# Altium project Light Sensor Node.PrjPcb
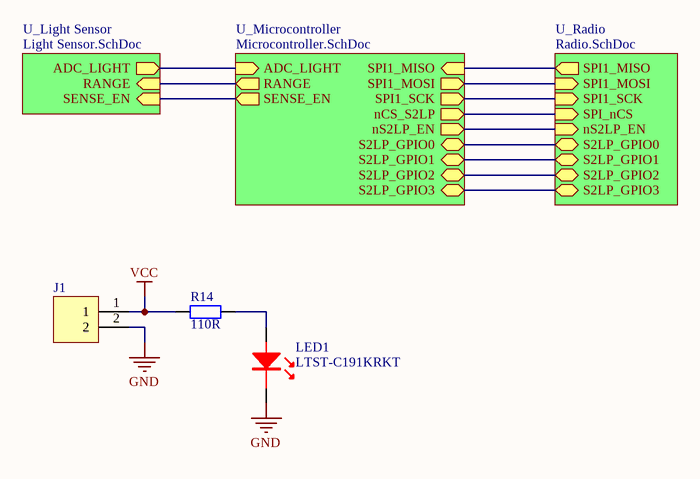
[diagram p0: Light Sensor Node.SchDoc]
4 sheets, 100 parts. Net scope: hierarchical (ports join the sheet entries above them; power ports are global).
Board file: Light Sensor Node.PcbDoc
Sheets:
  Light Sensor Node.SchDoc
    U_Microcontroller = Microcontroller.SchDoc
    U_Light Sensor = Light Sensor.SchDoc
    U_Radio = Radio.SchDoc

## Sheet Light Sensor Node.SchDoc
size A4

### Parts
J1  22-05-3021  [MOLEX_22-05-3021]  (value not drawn)
LED1  LTST-C191KRKT  [LITEON_LTST-C191KRKT]
R14  110R  [R0603]

### Sub-sheets
U_Light Sensor = Light Sensor.SchDoc: ADC_LIGHT (out), RANGE (in), SENSE_EN (in)
U_Microcontroller = Microcontroller.SchDoc: ADC_LIGHT (in), RANGE (out), SPI1_SCK (out), SPI1_MISO (in), SPI1_MOSI (out), nCS_S2LP (out), nS2LP_EN (out), SENSE_EN (out), S2LP_GPIO2 (bidir), S2LP_GPIO1 (bidir), S2LP_GPIO0 (bidir), S2LP_GPIO3 (bidir)
U_Radio = Radio.SchDoc: SPI1_SCK (in), SPI1_MISO (out), SPI1_MOSI (in), SPI_nCS (in), nS2LP_EN (in), S2LP_GPIO1 (bidir), S2LP_GPIO2 (bidir), S2LP_GPIO3 (bidir), S2LP_GPIO0 (bidir)

### Nets
GND: J1.2 LED1.K
VCC: J1.1 R14.1
ADC_LIGHT: sheet U_Microcontroller/ADC_LIGHT, sheet U_Light Sensor/ADC_LIGHT
GPIO0: sheet U_Microcontroller/S2LP_GPIO0, sheet U_Radio/S2LP_GPIO0
GPIO1: sheet U_Microcontroller/S2LP_GPIO1, sheet U_Radio/S2LP_GPIO1
GPIO2: sheet U_Microcontroller/S2LP_GPIO2, sheet U_Radio/S2LP_GPIO2
GPIO3: sheet U_Microcontroller/S2LP_GPIO3, sheet U_Radio/S2LP_GPIO3
nCS: sheet U_Microcontroller/nCS_S2LP, sheet U_Radio/SPI_nCS
nS2LP_EN: sheet U_Microcontroller/nS2LP_EN, sheet U_Radio/nS2LP_EN
RANGE: sheet U_Microcontroller/RANGE, sheet U_Light Sensor/RANGE
SENSE_EN: sheet U_Microcontroller/SENSE_EN, sheet U_Light Sensor/SENSE_EN
SPI1_MISO: sheet U_Microcontroller/SPI1_MISO, sheet U_Radio/SPI1_MISO
SPI1_MOSI: sheet U_Microcontroller/SPI1_MOSI, sheet U_Radio/SPI1_MOSI
SPI1_SCK: sheet U_Microcontroller/SPI1_SCK, sheet U_Radio/SPI1_SCK
NetLED1_A: LED1.A R14.2

### Library data of the parts
J1 = 2WAY: Manufacturer: Molex; Manufacturer Part Number: 22-05-3021
LED1 = LED_Red: Manufacturer: Lite On; Manufacturer Part Number: LTST-C191KRKT
R14 = RES: Manufacturer: Yageo; Manufacturer Part Number: RC0603FR-07110RL; Footprint: *

## Sheet Microcontroller.SchDoc
size A4
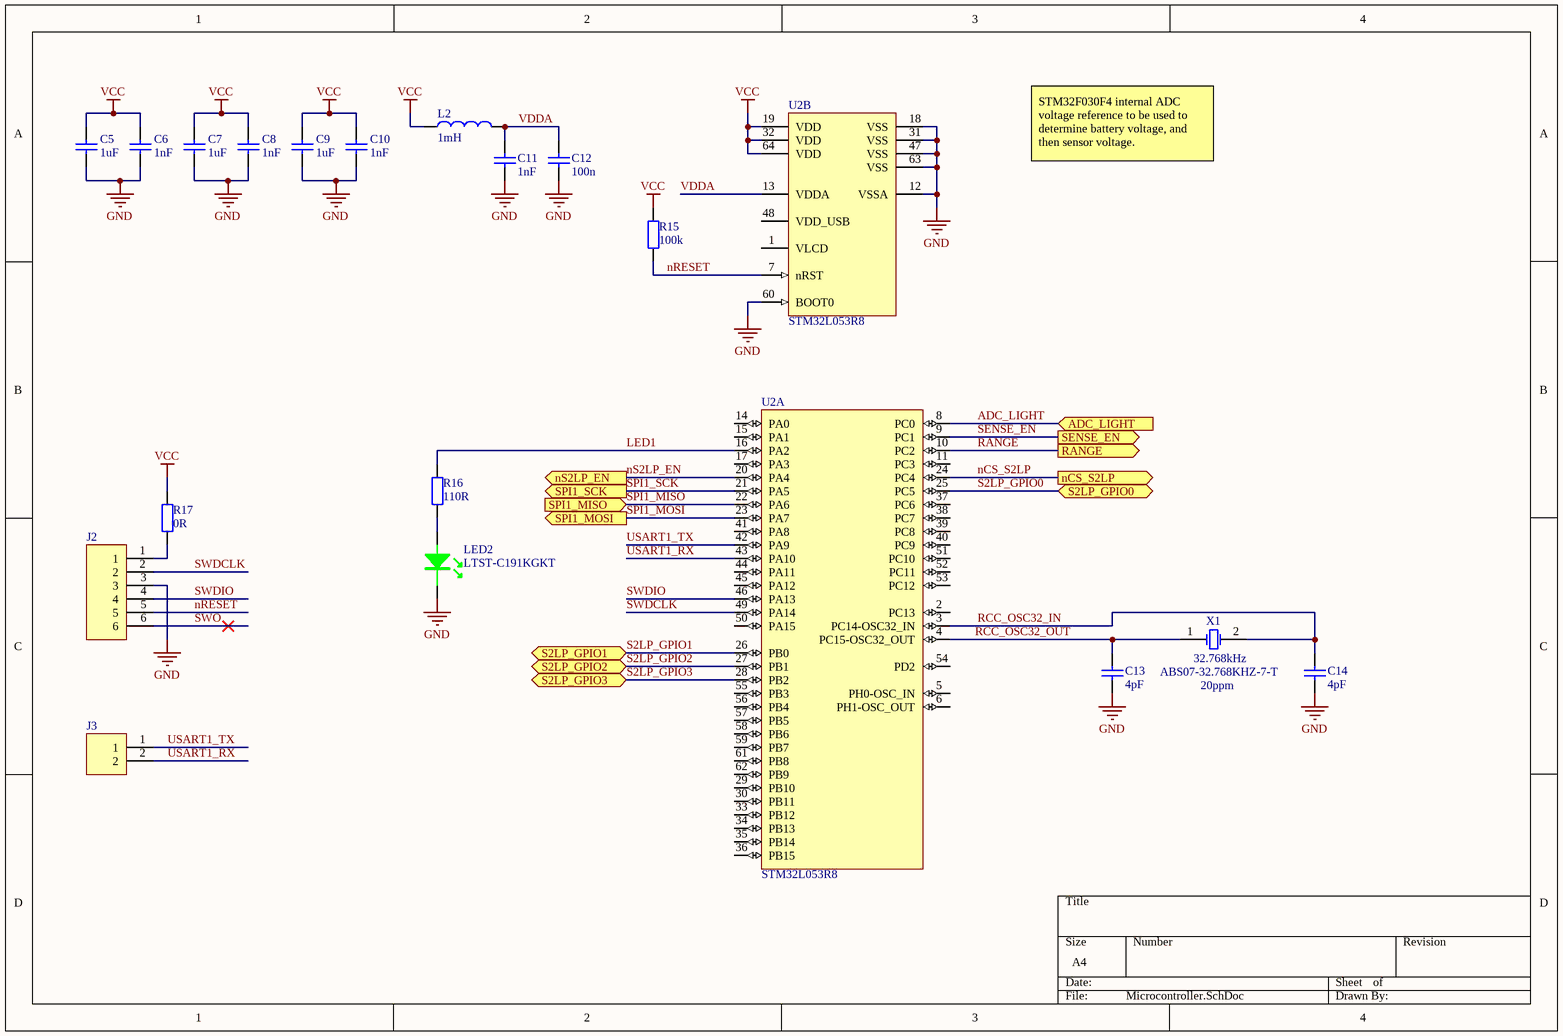
[diagram p1: Microcontroller.SchDoc]

### Parts
C5  Capacitance: 1uF  [C0603]
C6  1nF  [C0603]
C7  Capacitance: 1uF  [C0603]
C8  1nF  [C0603]
C9  Capacitance: 1uF  [C0603]
C10  1nF  [C0603]
C11  1nF  [C0603]
C12  100n  [C0603]
C13  4pF  [C0603]
C14  4pF  [C0603]
J2  (no value)  [HEADER_6WAY]
J3  (no value)  [HEADER_2WAY]
L2  Inductance: 1mH  [TAIYOYUDEN_CB2518T102K]  (hidden comment: IND)
LED2  LTST-C191KGKT  [LITEON_LTST-C191KGKT]
R15  100k  [R0603]
R16  110R  [R0603]
R17  0R  [R0603]
U2  STM32L053R8  [ST_STM32L053R8Tx]  (parts A,B of 2)
X1  32.768kHz  Manufacturer Part Number: ABS07-32.768KHZ-7-T  Frequency Tolerance: 20ppm  [Abracon_ABS07]

### Ports
ADC_LIGHT (in), nCS_S2LP (out), nS2LP_EN (out), RANGE (out), S2LP_GPIO0 (bidir), S2LP_GPIO1 (bidir), S2LP_GPIO2 (bidir), S2LP_GPIO3 (bidir), SENSE_EN (out), SPI1_MISO (in), SPI1_MOSI (out), SPI1_SCK (out)

### Nets
GND: C5.1 C6.2 C7.1 C8.2 C9.1 C10.2 C11.2 C12.1 C13.1 C14.1 J2.3 LED2.K U2.12(VSSA) U2.18(VSS) U2.31(VSS) U2.47(VSS) U2.60(BOOT0) U2.63(VSS)
VCC: C5.2 C6.1 C7.2 C8.1 C9.2 C10.1 L2.2 R15.1 R17.2 U2.19(VDD) U2.32(VDD) U2.64(VDD)
ADC_LIGHT: U2.8(PC0) ; port ADC_LIGHT
LED1: R16.1 U2.16(PA2)
nCS_S2LP: U2.24(PC4) ; port nCS_S2LP  [project net nCS]
nRESET: J2.5 R15.2 U2.7(nRST)
nS2LP_EN: U2.20(PA4) ; port nS2LP_EN
RANGE: U2.10(PC2) ; port RANGE
RCC_OSC32_IN: C14.2 U2.3(PC14-OSC32_IN) X1.2(OSC2)
RCC_OSC32_OUT: C13.2 U2.4(PC15-OSC32_OUT) X1.1(OSC1)
S2LP_GPIO0: U2.25(PC5) ; port S2LP_GPIO0  [project net GPIO0]
S2LP_GPIO1: U2.26(PB0) ; port S2LP_GPIO1  [project net GPIO1]
S2LP_GPIO2: U2.27(PB1) ; port S2LP_GPIO2  [project net GPIO2]
S2LP_GPIO3: U2.28(PB2) ; port S2LP_GPIO3  [project net GPIO3]
SENSE_EN: U2.9(PC1) ; port SENSE_EN
SPI1_MISO: U2.22(PA6) ; port SPI1_MISO
SPI1_MOSI: U2.23(PA7) ; port SPI1_MOSI
SPI1_SCK: U2.21(PA5) ; port SPI1_SCK
SWDCLK: J2.2 U2.49(PA14)
SWDIO: J2.4 U2.46(PA13)
SWO: J2.6
USART1_RX: J3.2 U2.43(PA10)
USART1_TX: J3.1 U2.42(PA9)
VDDA: C11.1 C12.2 L2.1 U2.13(VDDA)
NetJ2_1: J2.1 R17.1
NetLED2_A: LED2.A R16.2

Not connected (* = marked no-connect by the designer): U2 1(VLCD) 2(PC13) 5(PH0-OSC_IN) 6(PH1-OSC_OUT) 11(PC3) 14(PA0) 15(PA1) 17(PA3) 29(PB10) 30(PB11) 33(PB12) 34(PB13) 35(PB14) 36(PB15) 37(PC6) 38(PC7) 39(PC8) 40(PC9) 41(PA8) 44(PA11) 45(PA12) 48(VDD_USB) 50(PA15) 51(PC10) 52(PC11) 53(PC12) 54(PD2) 55(PB3) 56(PB4) 57(PB5) 58(PB6) 59(PB7) 61(PB8) 62(PB9)

### Notes on the sheet
- STM32F030F4 internal ADC voltage reference to be used to determine battery voltage, and then sensor voltage.

### Library data of the parts
C5 C7 C9 = CAP: Manufacturer: Yageo; Manufacturer Part Number: CC0603KRX7R9BB105; Voltage Rating: 50V
C6 C8 C10 C11 = CAP: Manufacturer: Yageo; Manufacturer Part Number: CC0603KRX7R9BB102; Voltage Rating: 50V
C12 = CAP: Manufacturer: Yageo; Manufacturer Part Number: CC0603ZRY5V9BB104
C13 C14 = CAP: Manufacturer: Yageo; Manufacturer Part Number: CC0603CRNPO9BN4R0
J2 = 6WAY
J3 = 2WAY
L2 = IND: Manufacturer: Taiyo Yuden; Manufacturer Part Number: CB2518T102K
LED2 = LED_Green: Manufacturer: Lite On; Manufacturer Part Number: LTST-C191KGKT
R15 = RES: Manufacturer: Yageo; Manufacturer Part Number: RC0603FR-07100KL; Tolerance: 1%; Footprint: *
R16 = RES: as R14 on sheet Light Sensor Node; Footprint: *
R17 = RES: Manufacturer: Yageo; Manufacturer Part Number: RC0603JR-070RL; Footprint: *
U2 = STM32L053R8: Manufacturer: ST; Manufacturer Part Number: STM32L053R8
X1 = ABRACON_ABS07: Crystal Oscillator; Manufacturer: Abracon; Frequency: 32.768kHz

## Sheet Light Sensor.SchDoc
size A4
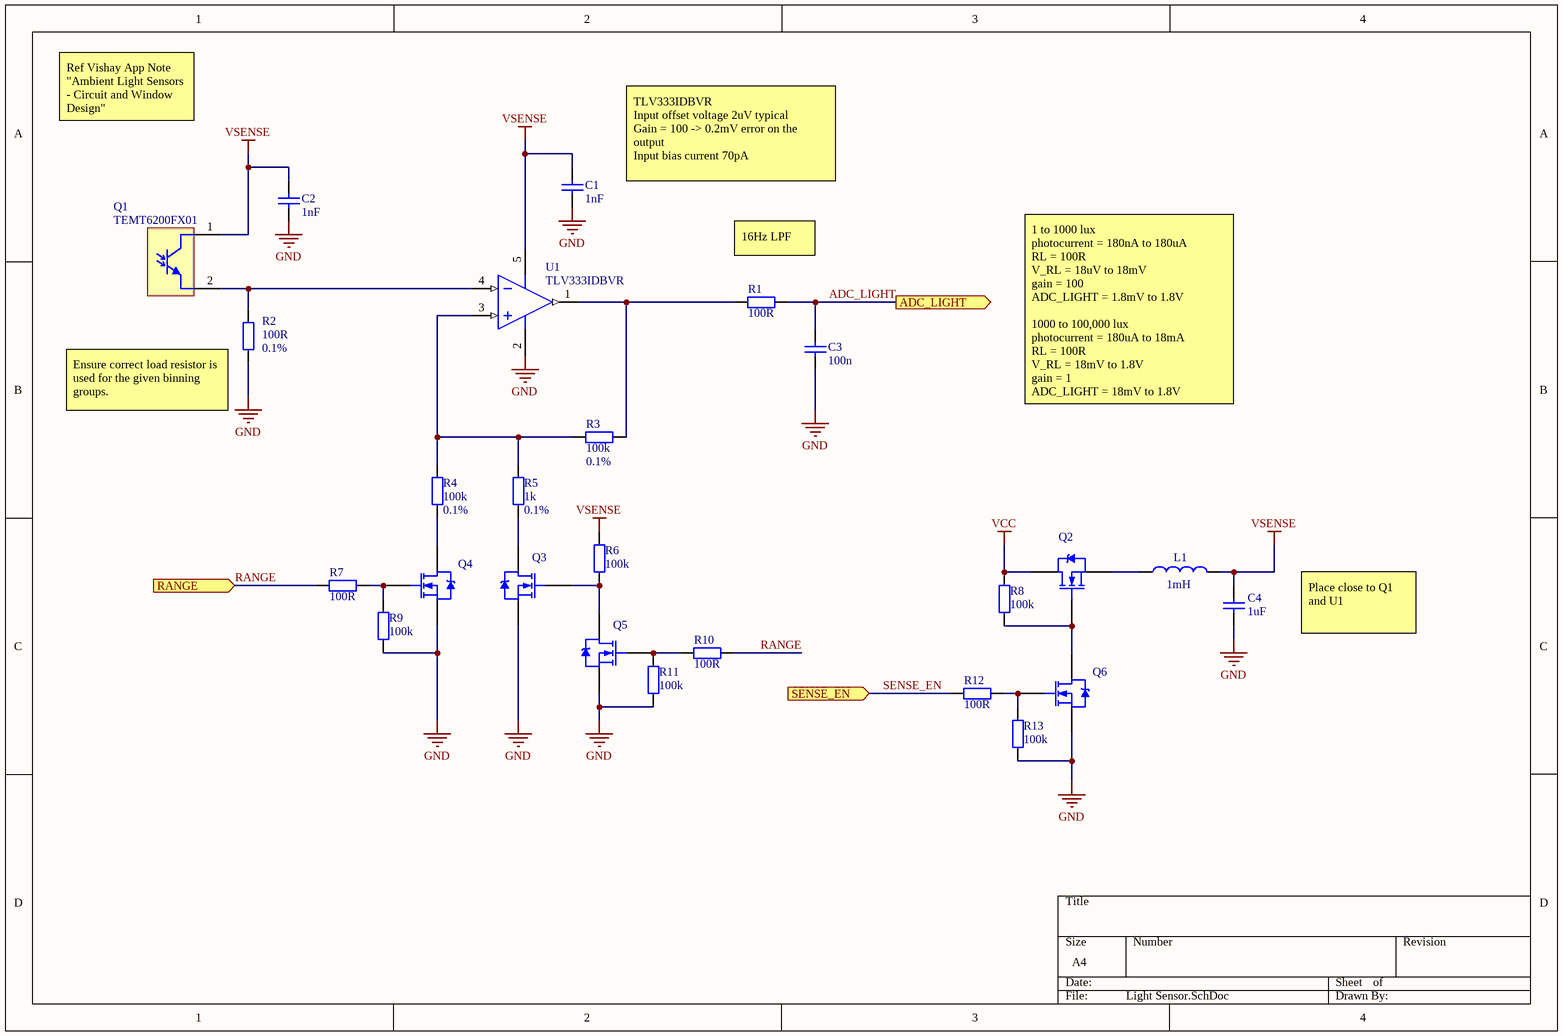
[diagram p2: Light Sensor.SchDoc]

### Parts
C1  1nF  [C0603]
C2  1nF  [C0603]
C3  100n  [C0603]
C4  Capacitance: 1uF  [C0603]
L1  Inductance: 1mH  [TAIYOYUDEN_CB2518T102K]  (hidden comment: IND)
Q1  TEMT6200FX01
Q2  2N7002ET1G  [ON_2N7002E]  (value not drawn)
Q3  2N7002ET1G  [ON_2N7002E]  (value not drawn)
Q4  2N7002ET1G  [ON_2N7002E]  (value not drawn)
Q5  2N7002ET1G  [ON_2N7002E]  (value not drawn)
Q6  2N7002ET1G  [ON_2N7002E]  (value not drawn)
R1  100R  [R0603]
R2  100R  Tolerance: 0.1%  [R0603]
R3  100k  Tolerance: 0.1%  [R0603]
R4  100k  Tolerance: 0.1%  [R0603]
R5  1k  Tolerance: 0.1%  [R0603]
R6  100k  [R0603]
R7  100R  [R0603]
R8  100k  [R0603]
R9  100k  [R0603]
R10  100R  [R0603]
R11  100k  [R0603]
R12  100R  [R0603]
R13  100k  [R0603]
U1  TLV333IDBVR  [TI_TLV333IDBVR]

### Ports
ADC_LIGHT (out), RANGE (in), SENSE_EN (in)

### Nets
GND: C1.2 C2.2 C3.1 C4.1 Q3.2(S) Q4.2(S) Q5.2(S) Q6.2(S) R2.1 R9.2 R11.2 R13.2 U1.2(V-)
VCC: Q2.3(D) R8.1
VSENSE: C1.1 C2.1 C4.2 L1.1 Q1.1(C) R6.1 U1.5(V+)
ADC_LIGHT: C3.2 R1.2 ; port ADC_LIGHT
RANGE: R7.1 R10.2 ; port RANGE
SENSE_EN: R12.1 ; port SENSE_EN
NetL1_2: L1.2 Q2.2(S)
NetQ1_2: Q1.2(E) R2.2 U1.4(IN_A-)
NetQ2_1: Q2.1(G) Q6.3(D) R8.2
NetQ3_1: Q3.1(G) Q5.3(D) R6.2
NetQ3_3: Q3.3(D) R5.2
NetQ4_1: Q4.1(G) R7.2 R9.1
NetQ4_3: Q4.3(D) R4.1
NetQ5_1: Q5.1(G) R10.1 R11.1
NetQ6_1: Q6.1(G) R12.2 R13.1
NetR1_1: R1.1 R3.2 U1.1(OUT_A)
NetR3_1: R3.1 R4.2 R5.1 U1.3(IN_A+)

### Notes on the sheet
- Ref Vishay App Note "Ambient Light Sensors - Circuit and Window Design"
- TLV333IDBVR
  Input offset voltage 2uV typical
  Gain = 100 -> 0.2mV error on the output
  Input bias current 70pA
- (near R1) 16Hz LPF
- (near R2) Ensure correct load resistor is used for the given binning groups.
- 1 to 1000 lux
  photocurrent = 180nA to 180uA
  RL = 100R
  V_RL = 18uV to 18mV
  gain = 100
  ADC_LIGHT = 1.8mV to 1.8V
  1000 to 100,000 lux
  photocurrent = 180uA to 18mA
  RL = 100R
  V_RL = 18mV to 1.8V
  gain = 1
  ADC_LIGHT = 18mV to 1.8V
- Place close to Q1 and U1

### Library data of the parts
C1 C2 = CAP: as C6 on sheet Microcontroller
C3 = CAP: as C12 on sheet Microcontroller
C4 = CAP: as C5 on sheet Microcontroller
L1 = IND: as L2 on sheet Microcontroller
Q1 = VISHAY_TEMT6200FX01: Manufacturer: Vishay; Manufacturer Part Number: TEMT6200FX01
Q2-Q6 = N-channel MOSFET: Manufacturer: ON Semiconductor; Manufacturer Part Number: 2N7002ET1G
R1 R7 R10 R12 = RES: Manufacturer: Yageo; Manufacturer Part Number: RC0603FR-07100RL; Tolerance: 1%; Footprint: *
R2 = RES: Manufacturer: Yageo; Manufacturer Part Number: RT0603BRD07100RL; Footprint: *
R3 R4 = RES: Manufacturer: Yageo; Manufacturer Part Number: RT0603BRD07100KL; Footprint: *
R5 = RES: Manufacturer: Yageo; Manufacturer Part Number: RT0603BRD071KL; Footprint: *
R6 R8 R9 R11 R13 = RES: as R15 on sheet Microcontroller; Footprint: *
U1 = OPAMP: Manufacturer: Texas Instruments; Manufacturer Part Number: TLV333IDBVR

## Sheet Radio.SchDoc
size A4
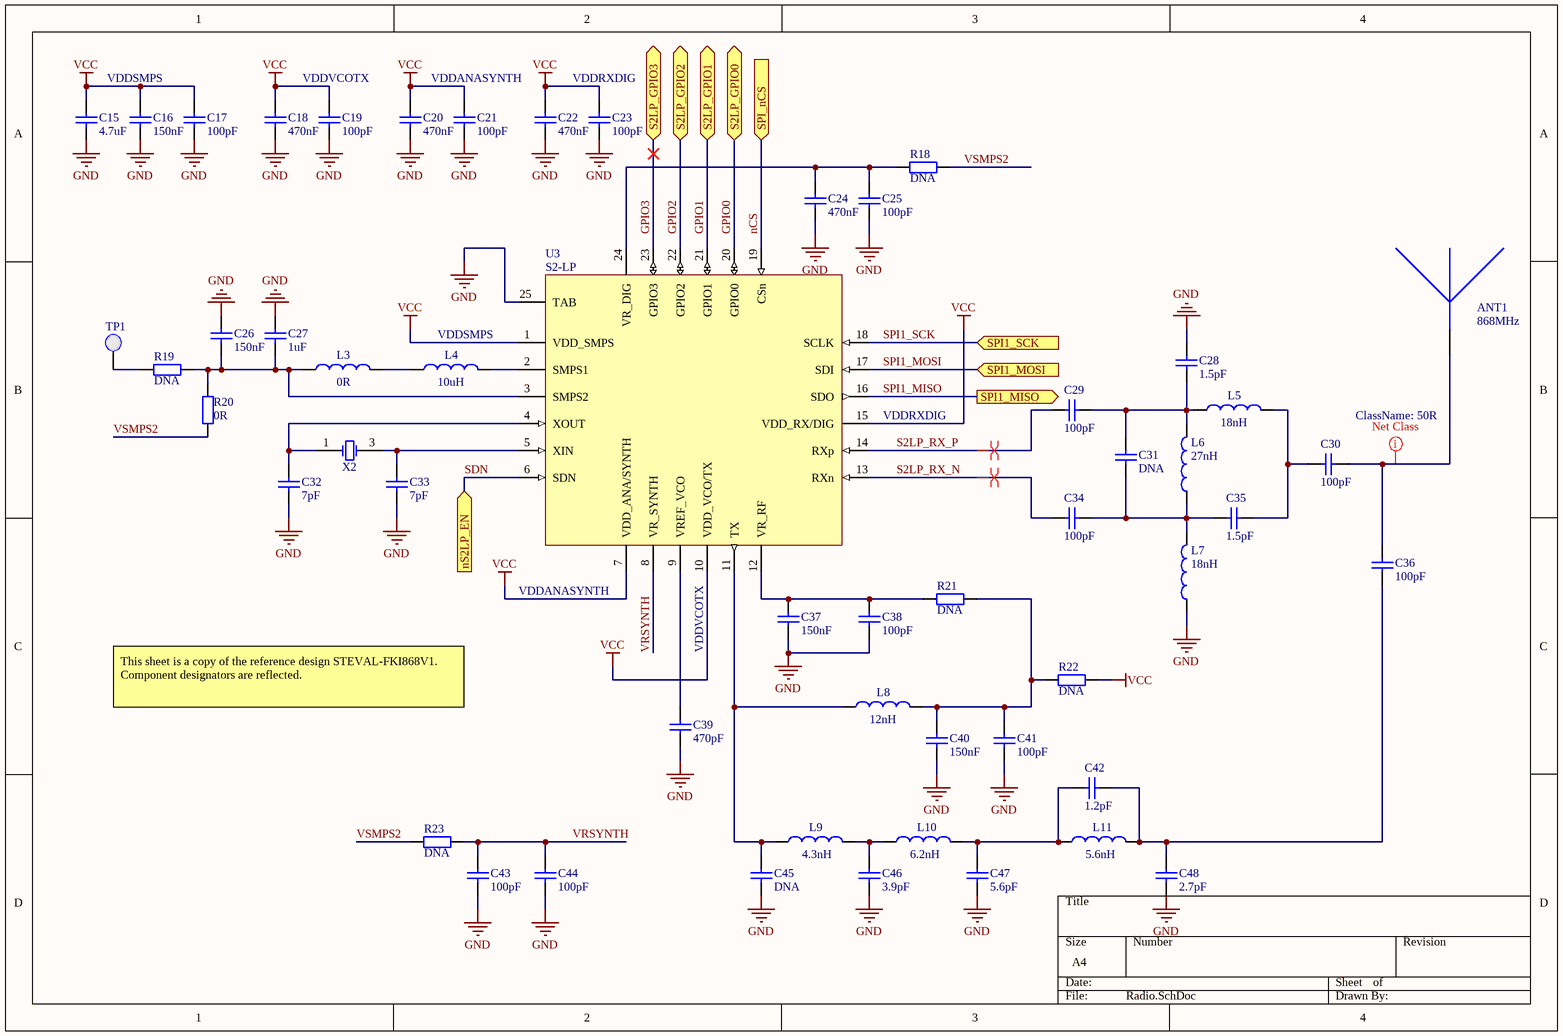
[diagram p3: Radio.SchDoc]

### Parts
ANT1  868MHz  [ANTENNA]
C15  4.7uF  [C0603]
C16  150nF  [C0402]
C17  100pF  [C0402]
C18  470nF  [C0402]
C19  100pF  [C0402]
C20  470nF  [C0402]
C21  100pF  [C0402]
C22  470nF  [C0402]
C23  100pF  [C0402]
C24  470nF  [C0402]
C25  100pF  [C0402]
C26  150nF  [C0402]
C27  1uF  [C0603]
C28  1.5pF  [C0402]
C29  100pF  [C0402]
C30  100pF  [C0402]
C31  DNA
C32  7pF  [C0805]
C33  7pF  [C0805]
C34  100pF  [C0402]
C35  1.5pF  [C0402]
C36  100pF  [C0402]
C37  150nF  [C0402]
C38  100pF  [C0402]
C39  470pF  [C0402]
C40  150nF  [C0402]
C41  100pF  [C0402]
C42  1.2pF  [C0402]
C43  100pF  [C0402]
C44  100pF  [C0402]
C45  DNA  [C0402]
C46  3.9pF  [C0402]
C47  5.6pF  [C0402]
C48  2.7pF  [C0402]
L3  0R  [R0402]
L4  Inductance: 10uH  [R0805]  (hidden comment: IND)
L5  Inductance: 18nH  [R0603]  (hidden comment: IND)
L6  Inductance: 27nH  [R0603]  (hidden comment: IND)
L7  Inductance: 18nH  [R0603]  (hidden comment: IND)
L8  Inductance: 12nH  [R0603]  (hidden comment: IND)
L9  Inductance: 4.3nH  [R0402]  (hidden comment: IND)
L10  Inductance: 6.2nH  [R0402]  (hidden comment: IND)
L11  Inductance: 5.6nH  [R0805]  (hidden comment: IND)
R18  DNA  [R0402]
R19  DNA  [R0402]
R20  0R  [R0402]
R21  DNA  [R0402]
R22  DNA  [R0402]
R23  DNA  [R0402]
TP1  TP_1mm  [TP_1mm]  (value not drawn)  (no BOM)
U3  S2-LP  [ST_S2LP]
X2  50MHz  [ABRACON_ABMM2]  (value not drawn)

### Ports
nS2LP_EN (in), S2LP_GPIO0 (bidir), S2LP_GPIO1 (bidir), S2LP_GPIO2 (bidir), S2LP_GPIO3 (bidir), SPI1_MISO (out), SPI1_MOSI (in), SPI1_SCK (in), SPI_nCS (in)

### Nets
GND: C15.1 C16.1 C17.1 C18.1 C19.1 C20.1 C21.1 C22.1 C23.1 C24.1 C25.1 C26.2 C27.2 C28.1 C32.1 C33.1 C37.1 C38.1 C39.1 C40.1 C41.1 C43.1 C44.1 C45.1 C46.1 C47.1 C48.1 L7.2 U3.25(TAB)
VCC: C15.2 C16.2 C17.2 C18.2 C19.2 C20.2 C21.2 C22.2 C23.2 R22.2 U3.1(VDD_SMPS) U3.7(VDD_ANA/SYNTH) U3.10(VDD_VCO/TX) U3.15(VDD_RX/DIG)
GPIO0: U3.20(GPIO0) ; port S2LP_GPIO0
GPIO1: U3.21(GPIO1) ; port S2LP_GPIO1
GPIO2: U3.22(GPIO2) ; port S2LP_GPIO2
GPIO3: U3.23(GPIO3) ; port S2LP_GPIO3
nCS: U3.19(CSn) ; port SPI_nCS
S2LP_RX_N: C34.2 U3.13(RXn)
S2LP_RX_P: C29.2 U3.14(RXp)
SDN: U3.6(SDN) ; port nS2LP_EN  [project net nS2LP_EN]
SPI1_MISO: U3.16(SDO) ; port SPI1_MISO
SPI1_MOSI: U3.17(SDI) ; port SPI1_MOSI
SPI1_SCK: U3.18(SCLK) ; port SPI1_SCK
VRSYNTH: C43.2 C44.2 R23.2 U3.8(VR_SYNTH)
VSMPS2: R18.2 R20.1 R23.1
NetANT1_1: ANT1.1(V+) C30.1 C36.2
NetC24_2: C24.2 C25.2 R18.1 U3.24(VR_DIG)
NetC26_1: C26.1 C27.1 L3.2 R19.2 R20.2 U3.3(SMPS2)
NetC28_2: C28.2 C29.1 C31.2 L5.2 L6.1
NetC30_2: C30.2 C35.1 L5.1
NetC31_1: C31.1 C34.1 C35.2 L6.2 L7.1
NetC32_2: C32.2 U3.4(XOUT) X2.1(OSC1)
NetC33_2: C33.2 U3.5(XIN) X2.3(OSC2)
NetC36_1: C36.1 C42.1 C48.2 L11.1
NetC37_2: C37.2 C38.2 R21.1 U3.12(VR_RF)
NetC39_2: C39.2 U3.9(VREF_VCO)
NetC40_2: C40.2 C41.2 L8.1 R21.2 R22.1
NetC42_2: C42.2 C47.2 L10.1 L11.2
NetC45_2: C45.2 L8.2 L9.2 U3.11(TX)
NetC46_2: C46.2 L9.1 L10.2
NetL3_1: L3.1 L4.2
NetL4_1: L4.1 U3.2(SMPS1)
NetR19_1: R19.1 TP1.1

### Layout directives
net class 50R: NetANT1_1
differential pair: S2LP_RX_N, S2LP_RX_P

### Notes on the sheet
- VDDSMPS
- VDDVCOTX
- VDDANASYNTH
- VDDRXDIG
- (near L4) VDDSMPS
- (near U3) VDDRXDIG
- (near U3) VDDANASYNTH
- This sheet is a copy of the reference design STEVAL-FKI868V1. Component designators are reflected.

### Library data of the parts
ANT1 = ANTENNA
C15 = CAP: Manufacturer: MURATA; Manufacturer Part Number: GRM188R60J475KE19
C16 C26 C37 C40 = CAP: Manufacturer: MURATA; Manufacturer Part Number: GRM155R61A154KE19
C17 C19 C21 C23 C25 C29 C30 C34 C36 C38 C41 C43 C44 = CAP: Manufacturer: MURATA; Manufacturer Part Number: GRM1555C1H101JA01D
C18 C20 C22 C24 = CAP: Manufacturer: MURATA; Manufacturer Part Number: GRM155R61A474KE15
C27 = CAP: Manufacturer: MURATA; Manufacturer Part Number: GRM188R60J105KA01D
C28 C35 = CAP: Manufacturer: MURATA; Manufacturer Part Number: GRM1555C1H1R5CA01D
C31 C45 = CAP
C32 C33 = CAP: Manufacturer: Yageo; Manufacturer Part Number: CC0805DRNPO9BN7R0
C39 = CAP: Manufacturer: Murata; Manufacturer Part Number: GRM1555C1H471JA01
C42 = CAP: Manufacturer: MURATA; Manufacturer Part Number: GRM1555C1H1R2CA01D
C46 = CAP: Manufacturer: MURATA; Manufacturer Part Number: GRM1555C1H3R9CA01D
C47 = CAP: Manufacturer: MURATA; Manufacturer Part Number: GRM1555C1H5R6CA01D
C48 = CAP: Manufacturer: MURATA; Manufacturer Part Number: GRM1555C1H2R7BA01D
L3 = IND: Manufacturer: TE Connectivity; Manufacturer Part Number: CRG0402ZR
L4 = IND: Manufacturer: MURATA; Manufacturer Part Number: LQM21FN100M70L
L5 L7 = IND: Manufacturer: MURATA; Manufacturer Part Number: LQG15HS18NJ02D
L6 = IND: Manufacturer: MURATA; Manufacturer Part Number: LQG15HS27NJ02D
L8 = IND: Manufacturer: MURATA; Manufacturer Part Number: LQG18HN12NJ00D
L9 = IND: Manufacturer: MURATA; Manufacturer Part Number: LQG15HS4N3S02D
L10 = IND: Manufacturer: MURATA; Manufacturer Part Number: LQG15HN6N2S02D
L11 = IND: Manufacturer: MURATA; Manufacturer Part Number: LQW2BAS5N6J00L
R18 R19 R21-R23 = RES: Footprint: *
R20 = RES: Manufacturer: TE Connectivity; Manufacturer Part  Number: CRG0402ZR
U3 = ST_S2-LP: Manufacturer: ST Microelectronics; Manufacturer Part Number: S2-LP
X2 = OSC: Crystal Oscillator; Manufacturer: ABRACON; Manufacturer Part Number: ABMM2-50.000MHZ-E2F-T

## Nets that join several sheets
GND: Light Sensor Node (J1.2 LED1.K), Microcontroller (18 pins), Light Sensor (13 pins), Radio (29 pins)
VCC: Light Sensor Node (J1.1 R14.1), Microcontroller (12 pins), Light Sensor (Q2.3 R8.1), Radio (14 pins)
ADC_LIGHT: Microcontroller (U2.8), Light Sensor (C3.2 R1.2)
GPIO0: Microcontroller (U2.25), Radio (U3.20)
GPIO1: Microcontroller (U2.26), Radio (U3.21)
GPIO2: Microcontroller (U2.27), Radio (U3.22)
GPIO3: Microcontroller (U2.28), Radio (U3.23)
nCS: Microcontroller (U2.24), Radio (U3.19)
nS2LP_EN: Microcontroller (U2.20), Radio (U3.6)
RANGE: Microcontroller (U2.10), Light Sensor (R7.1 R10.2)
SENSE_EN: Microcontroller (U2.9), Light Sensor (R12.1)
SPI1_MISO: Microcontroller (U2.22), Radio (U3.16)
SPI1_MOSI: Microcontroller (U2.23), Radio (U3.17)
SPI1_SCK: Microcontroller (U2.21), Radio (U3.18)

## Assembly variants
Light Sensor Node: all parts fitted